# EAGLE schematic electric_fence (EAGLE 7.7.0)
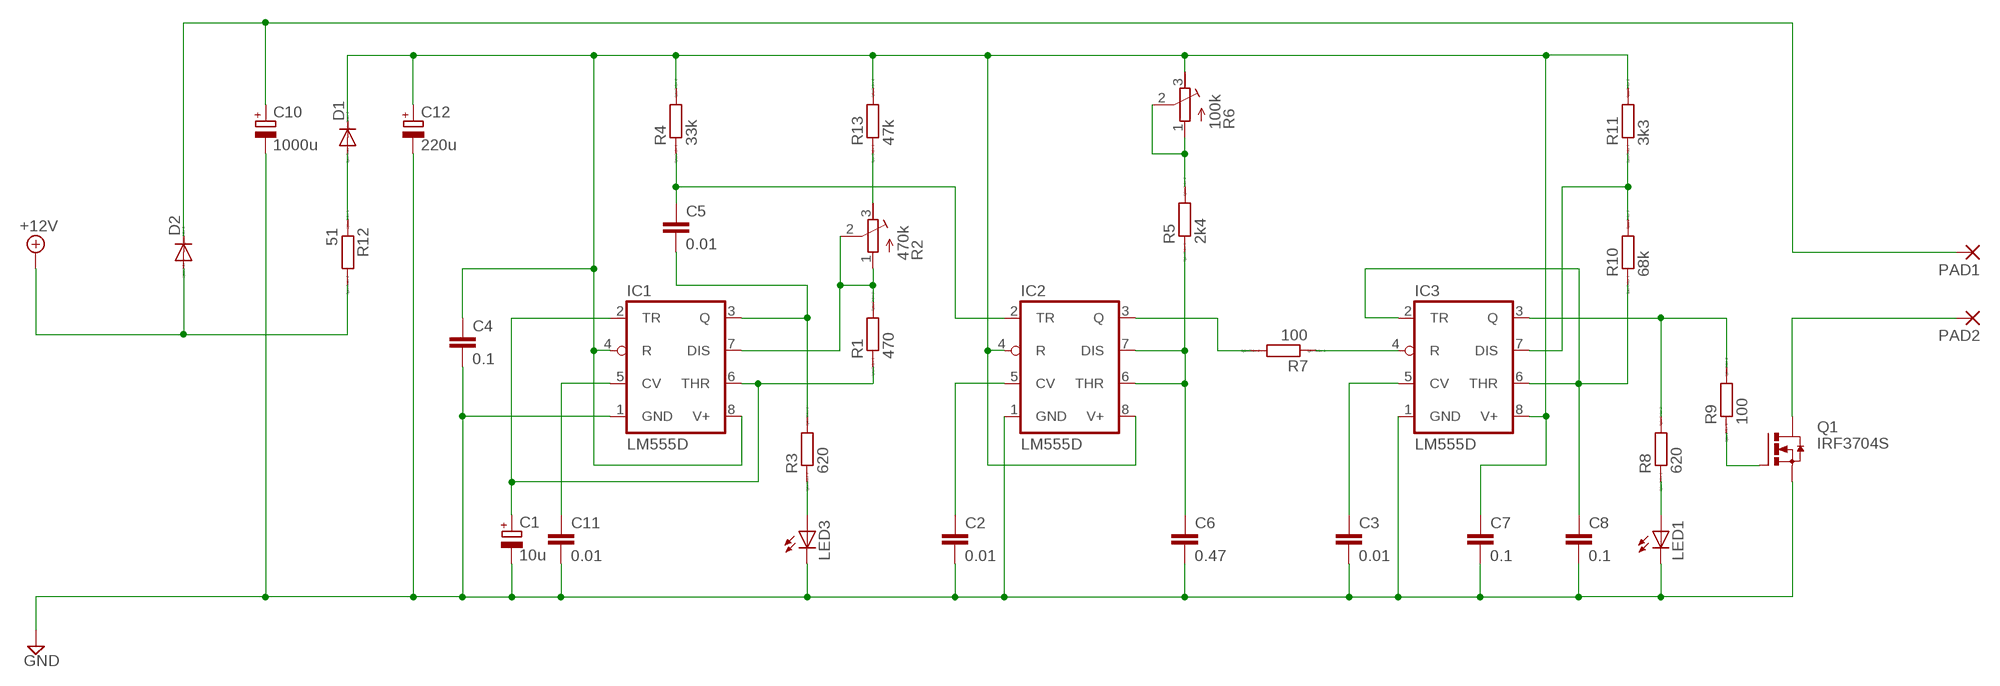
[diagram p0: schematic, sheet 1]

## Parts
C1  10u  CPOL-EUE2-4  [E2-4]
C2  0.01  C-EUC0402  [C0402]
C3  0.01  C-EUC0402  [C0402]
C4  0.1  C-EUC0402  [C0402]
C5  0.01  C-EUC0402  [C0402]
C6  0.47  C-EUC0402  [C0402]
C7  0.1  C-EUC0402  [C0402]
C8  0.1  C-EUC0402  [C0402]
C10  1000u  CPOL-EUE2-4  [E2-4]
C11  0.01  C-EUC0402  [C0402]
C12  220u  CPOL-EUE2-4  [E2-4]
D1  DIODE-DO-214AC  [DO-214AC]
D2  DIODE-DO-214AC  [DO-214AC]
IC1  LM555D  [SO08]
IC2  LM555D  [SO08]
IC3  LM555D  [SO08]
LED1  LEDCHIP-LED0805  [CHIP-LED0805]
LED3  LEDCHIP-LED0805  [CHIP-LED0805]
PAD1  SMD5  [SMD2,54-5,08]
PAD2  SMD5  [SMD2,54-5,08]
Q1  IRF3704S  [D2PACK]
R1  470  R  [R0805]
R2  470k  R-TRIMM4G/J  [RTRIM4G/J]
R3  620  R  [R0805]
R4  33k  R  [R0805]
R5  2k4  R  [R0805]
R6  100k  R-TRIMM4G/J  [RTRIM4G/J]
R7  100  R  [R0805]
R8  620  R  [R0805]
R9  100  R  [R0805]
R10  68k  R  [R0805]
R11  3k3  R  [R0805]
R12  51  R  [R0805]
R13  47k  R  [R0805]

## Nets
+12V: D2.A R12.2
GND: C1.- C2.2 C3.2 C4.2 C6.2 C7.2 C8.2 C10.- C11.2 C12.- IC1.1(GND) IC2.1(GND) IC3.1(GND) LED1.C LED3.C Q1.3(S)
N$2: C2.1 IC2.5(CV)
N$3: C3.1 IC3.5(CV)
N$4: R5.2 R6.1(A) R6.2(S)
N$5: C1.+ IC1.2(TR) IC1.6(THR) R1.1
N$6: IC1.7(DIS) R1.2 R2.1(A) R2.2(S)
N$7: C5.2 IC1.3(Q) R3.2
N$8: LED3.A R3.1
N$9: C5.1 IC2.2(TR) R4.1
N$10: C6.1 IC2.6(THR) IC2.7(DIS) R5.1
N$11: IC2.3(Q) R7.2
N$12: IC3.4(R) R7.1
N$13: C8.1 IC3.2(TR) IC3.6(THR) R10.1
N$14: C11.1 IC1.5(CV)
N$15: C4.1 C7.1 C12.+ D1.C IC1.4(R) IC1.8(V+) IC2.4(R) IC2.8(V+) IC3.8(V+) R4.2 R6.3(E) R11.2 R13.2
N$16: IC3.3(Q) R8.2 R9.2
N$17: LED1.A R8.1
N$18: C10.+ D2.C PAD1.1(P)
N$19: Q1.1(G) R9.1
N$20: D1.A R12.1
N$21: PAD2.1(P) Q1.2(D)
N$22: IC3.7(DIS) R10.2 R11.1
N$23: R2.3(E) R13.1

## Library data of the parts
C1 C10 C12 = resistor:CPOL-EU: POLARIZED CAPACITOR, European symbol
C2-C8 C11 = rcl:C-EU: CAPACITOR, European symbol
D1 D2 = diode:DIODE-: DIODE
IC1-IC3 = linear:*555: TIMER
LED1 LED3 = led:LED: LED OSRAM: - CHIPLED LG R971, LG N971, LY N971, LG Q971, LY Q971, LO R971, LY R971 LH N974, LH R974 LS Q976, LO Q976, LY Q976 LO Q996 - Hyper CHIPLED LW Q18S LB Q993, LB Q99A, LB R99A - SideLED LS A670, LO A670, LY A670, LG A670, LP A670 LB A673, LV A673, LT A673, LW A673 LH A674 LY A675 LS A676, LA A676, LO A676, LY A676, LW A676 LS A679, LY A679, LG A679 - Hyper Micro SIDELED® LS Y876, LA Y876, LO Y876, LY Y876 LT Y87S - SmartLED LW L88C, LW L88S LB L89C, LB L89S, LG L890 LS L89K, LO L89K, LY L89K LS L896, LA L896, LO L896, LY L896 - TOPLED LS T670, LO T670, LY T670, LG T670, LP T670 LSG T670, LSP T670, LSY T670, LOP T670, LYG T670 LG T671, LOG T671, LSG T671 LB T673, LV T673, LT T673, LW T673 LH T674 LS T676, LA T676, LO T676, LY T676, LB T676, LH T676, LSB T676, LW T676 LB T67C, LV T67C, LT T67C, LS T67K, LO T67K, LY T67K, LW E67C LS E67B, LA E67B, LO E67B, LY E67B, LB E67C, LV E67C, LT E67C LW T67C LS T679, LY T679, LG T679 LS T770, LO T770, LY T770, LG T770, LP T770 LB T773, LV T773, LT T773, LW T773 LH T774 LS E675, LA E675, LY E675, LS T675 LS T776, LA T776, LO T776, LY T776, LB T776 LHGB T686 LT T68C, LB T68C - Hyper Mini TOPLED® LB M676 - Mini TOPLED Santana® LG M470 LS M47K, LO M47K, LY M47K Source: http://www.osram.convergy.de LUXEON: - LUMILED® LXK2-PW12-R00, LXK2-PW12-S00, LXK2-PW14-U00, LXK2-PW14-V00 LXK2-PM12-R00, LXK2-PM12-S00, LXK2-PM14-U00 LXK2-PE12-Q00, LXK2-PE12-R00, LXK2-PE12-S00, LXK2-PE14-T00, LXK2-PE14-U00 LXK2-PB12-K00, LXK2-PB12-L00, LXK2-PB12-M00, LXK2-PB14-N00, LXK2-PB14-P00, LXK2-PB14-Q00 LXK2-PR12-L00, LXK2-PR12-M00, LXK2-PR14-Q00, LXK2-PR14-R00 LXK2-PD12-Q00, LXK2-PD12-R00, LXK2-PD12-S00 LXK2-PH12-R00, LXK2-PH12-S00 LXK2-PL12-P00, LXK2-PL12-Q00, LXK2-PL12-R00 Source: www.luxeon.com KINGBRIGHT: KA-3528ASYC Source: www.kingbright.com
PAD1 PAD2 = wirepad:SMD5: SMD PAD
Q1 = transistor-power:IRF3704: SMPS MOSFET HEXFET® Power MOSFET Source: http://www.irf.com/product-info/datasheets/data/irf3704.pdf
R1 R3-R5 R7-R13 = eagle-ltspice:R: RESISTOR, European symbol; SPICEMODEL: NONE; SPICEPREFIX: R
R2 R6 = resistor:R-TRIMM: Trimm resistor